# EAGLE design pui20 (EAGLE 9.5.2)
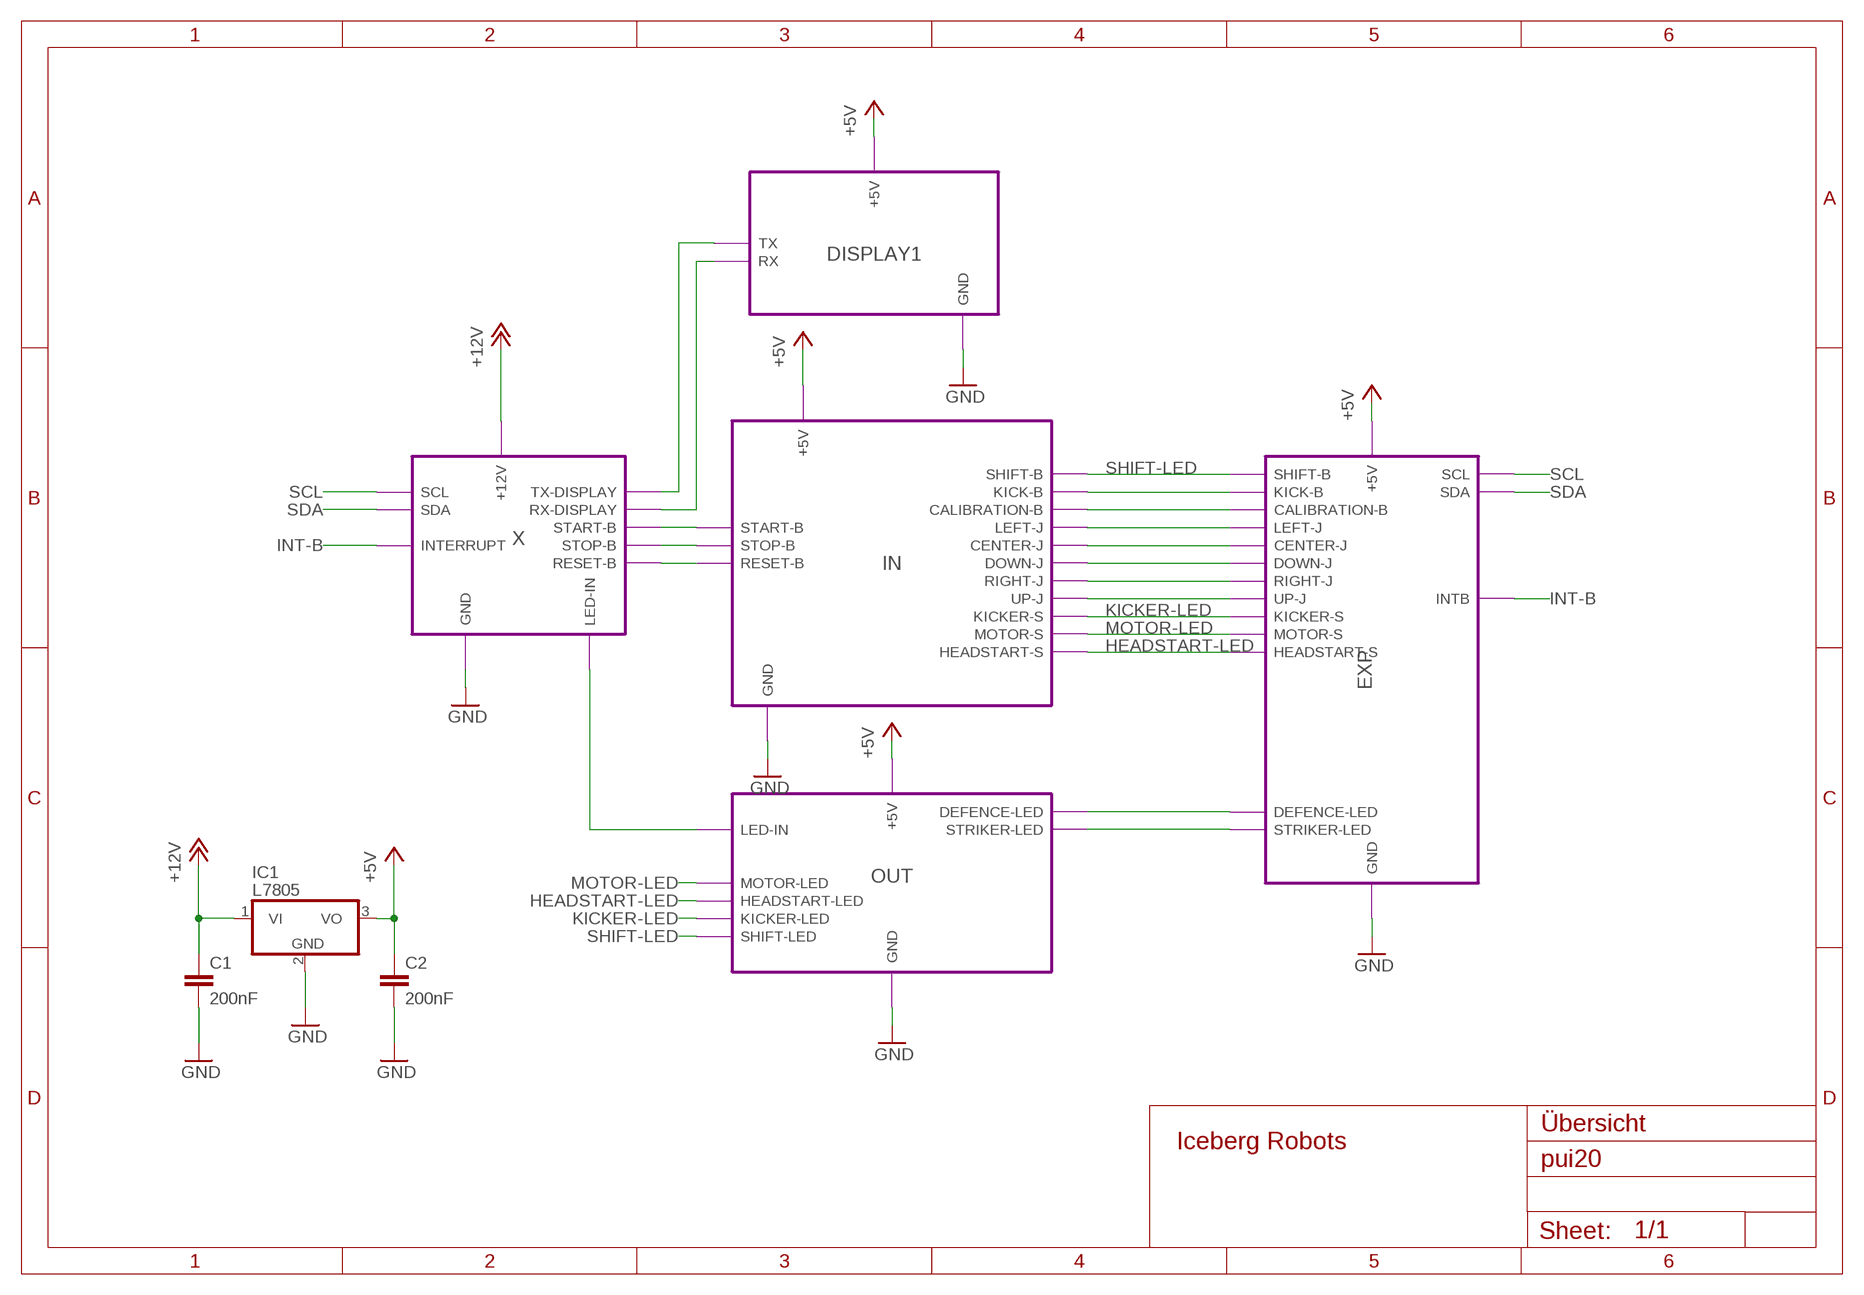
[diagram p0: schematic, sheet 1]

## Parts
C1  200nF  C0805  [C0805]
C2  200nF  C0805  [C0805]
IC1  L7805  [TO220V]

## Module instances
IN = EINGABE
X = ANSCHLUSS
OUT = AUSGABE
EXP = EXPANDER
DISPLAY1 = DISPLAY

## Nets
+5V: C2.1 IC1.3(VO) ; port EXP.+5V OUT.+5V DISPLAY1.+5V IN.+5V
+12V: C1.1 IC1.1(VI) ; port X.+12V
CALIBRATION-B: port IN.CALIBRATION-B EXP.CALIBRATION-B
CENTER-J: port IN.CENTER-J EXP.CENTER-J
DEFENCE-LED: port EXP.DEFENCE-LED OUT.DEFENCE-LED
DOWN-J: port IN.DOWN-J EXP.DOWN-J
GND: C1.2 C2.2 IC1.2(GND) ; port EXP.GND OUT.GND DISPLAY1.GND X.GND IN.GND
HEADSTART-LED: port OUT.HEADSTART-LED IN.HEADSTART-S EXP.HEADSTART-S
INT-B: port X.INTERRUPT EXP.INTB
KICK-B: port IN.KICK-B EXP.KICK-B
KICKER-LED: port OUT.KICKER-LED IN.KICKER-S EXP.KICKER-S
LED-IN: port X.LED-IN OUT.LED-IN
LEFT-J: port IN.LEFT-J EXP.LEFT-J
MOTOR-LED: port OUT.MOTOR-LED IN.MOTOR-S EXP.MOTOR-S
RESET-B: port X.RESET-B IN.RESET-B
RIGHT-J: port IN.RIGHT-J EXP.RIGHT-J
RX: port X.RX-DISPLAY DISPLAY1.RX
SCL: port X.SCL EXP.SCL
SDA: port X.SDA EXP.SDA
SHIFT-LED: port OUT.SHIFT-LED IN.SHIFT-B EXP.SHIFT-B
START-B: port IN.START-B X.START-B
STOP-B: port IN.STOP-B X.STOP-B
STRIKER-LED: port EXP.STRIKER-LED OUT.STRIKER-LED
TX: port DISPLAY1.TX X.TX-DISPLAY
UP-J: port IN.UP-J EXP.UP-J

## Notes on the sheet
- Übersicht

## Library data of the parts
C1 C2 = iceberg20:C: Capacitor, SMD 0805, Value wird festgelegt; BESTAND: -; HERSTELLER: -; HERSTELLER-NR: -; SUPPLIER: -; SUPPLIER-NR: -; TOLERANZ: 10%; V-MAX: 20V
IC1 = iceberg20:L7805: Spannungsregler, 5 V, TO220, 35 V Datenblatt: Link <https://www.buerklin.com/medias/sys_master/root/h6e/had/8866986229790/8866986229790.pdf>; BESTAND: ?; HERSTELLER: STMicroelectronics; HERSTELLER-NR: L7805AB-V; SUPPLIER: Bürklin; SUPPLIER-NR: 40S9756

## Module EINGABE
Ports: RESET-B(out) KICKER-S(out) HEADSTART-S(out) MOTOR-S(out) KICK-B(out) SHIFT-B(out) CALIBRATION-B(out) CENTER-J(out) DOWN-J(out) LEFT-J(out) RIGHT-J(out) UP-J(out) START-B(out) STOP-B(out) +5V(pwr) GND(pwr)
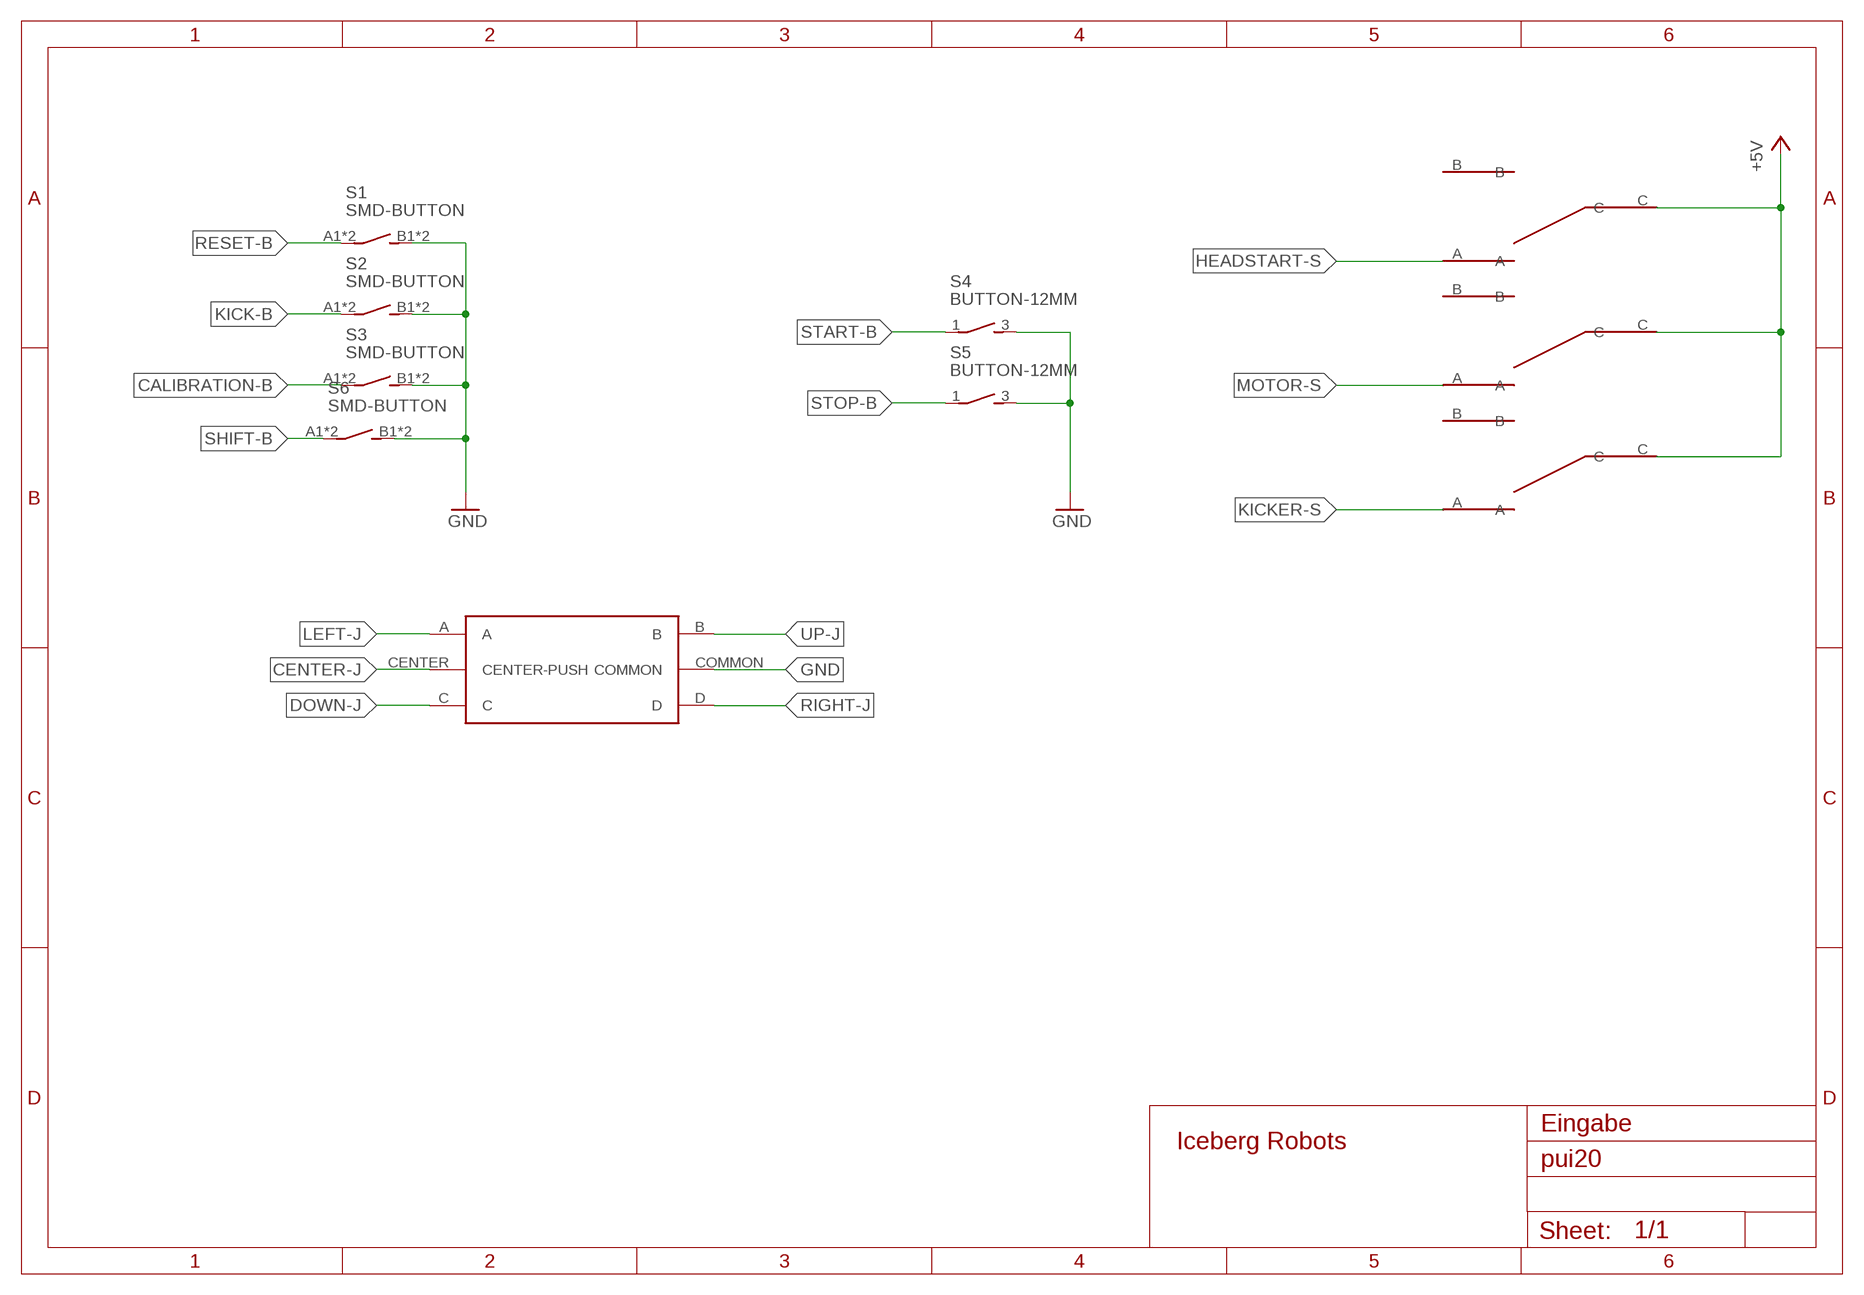
[diagram p1: schematic, module EINGABE, sheet 1]

### Parts
S1  SMD-BUTTON  [SWITCH-6MM-SMD]
S2  SMD-BUTTON  [SWITCH-6MM-SMD]
S3  SMD-BUTTON  [SWITCH-6MM-SMD]
S4  BUTTON-12MM  [SWITCH-12MM-THT]
S5  BUTTON-12MM  [SWITCH-12MM-THT]
S6  SMD-BUTTON  [SWITCH-6MM-SMD]
S7  TOGGLE-SWITCH  [TOGGLE-SWITCH]
S8  TOGGLE-SWITCH  [TOGGLE-SWITCH]
S9  TOGGLE-SWITCH  [TOGGLE-SWITCH]
U$1  JOYSTICK  [SKRHAAE010]

### Nets
+5V: S7.C S8.C S9.C
CALIBRATION-B: S3.A1(P) S3.A2(P)
CENTER-J: U$1.CENTER(CENTER-PUSH)
DOWN-J: U$1.C
GND: S1.B1(S) S1.B2(S) S2.B1(S) S2.B2(S) S3.B1(S) S3.B2(S) S4.3(S) S5.3(S) S6.B1(S) S6.B2(S) U$1.COMMON
HEADSTART-S: S7.A
KICK-B: S2.A1(P) S2.A2(P)
KICKER-S: S9.A
LEFT-J: U$1.A
MOTOR-S: S8.A
RESET-B: S1.A1(P) S1.A2(P)
RIGHT-J: U$1.D
SHIFT-B: S6.A1(P) S6.A2(P)
START-B: S4.1(P)
STOP-B: S5.1(P)
UP-J: U$1.B
Unconnected: S7.B S8.B S9.B

### Notes on the sheet
- Eingabe

### Library data of the parts
S1-S3 S6 = iceberg20:SMD-BUTTON: SMD-Button, 6mm x 6mm Datenblatt: Link <https://www.buerklin.com/medias/sys_master/root/h03/h3f/8877444497438/8877444497438.pdf>; BESTAND: 0; HERSTELLER: Alcoswitch; HERSTELLER-NR: 4-1437565-1 FSM4JSMA; SUPPLIER: Bürklin; SUPPLIER-NR: 12G482
S4 S5 = iceberg20:BUTTON-12MM: BitKurzhubtaster, 1-polig, Schaltfunktion: SPST-NO , 1 Schließer, Anschluss: Leiterplattenanschluss, Schutzart: IP 67, Farbe Betätiger: gelb, Betätigungskraft: 2,55 N, Größe: 12x12 mm, Höhe: 4,3 mm Datenblatt: Link <https://www.buerklin.com/medias/sys_master/root/h57/h6b/8876470075422/8876470075422.pdf>; BESTAND: ?; HERSTELLER: Omron; HERSTELLER-NR: 13G7561; SUPPLIER: Bürklin; SUPPLIER-NR: B3F-4005
S7-S9 = iceberg20:TOGGLE-SWITCH: Bitte hier mit dem Befehl Description eine passende Beschreibung angeben (kann kurz sein) und Datenblatt verlinken Datenblatt: Link <https://www.iceberg-robots.de/>
U$1 = iceberg20:JOYSTICK: Multi-direktionale Schalter 4 Dir Center Push 50mA 12V DC Datenblatt: Link <https://www.mouser.de/datasheet/2/15/skqu-1155891.pdf>; BESTAND: 0; HERSTELLER: ALPS; HERSTELLER-NR: SKRHAAE010; SUPPLIER: Mouser; SUPPLIER-NR: 688-SKRHAAE010

## Module DISPLAY
Ports: +5V(pwr) GND(pwr) RX(in) TX(out)
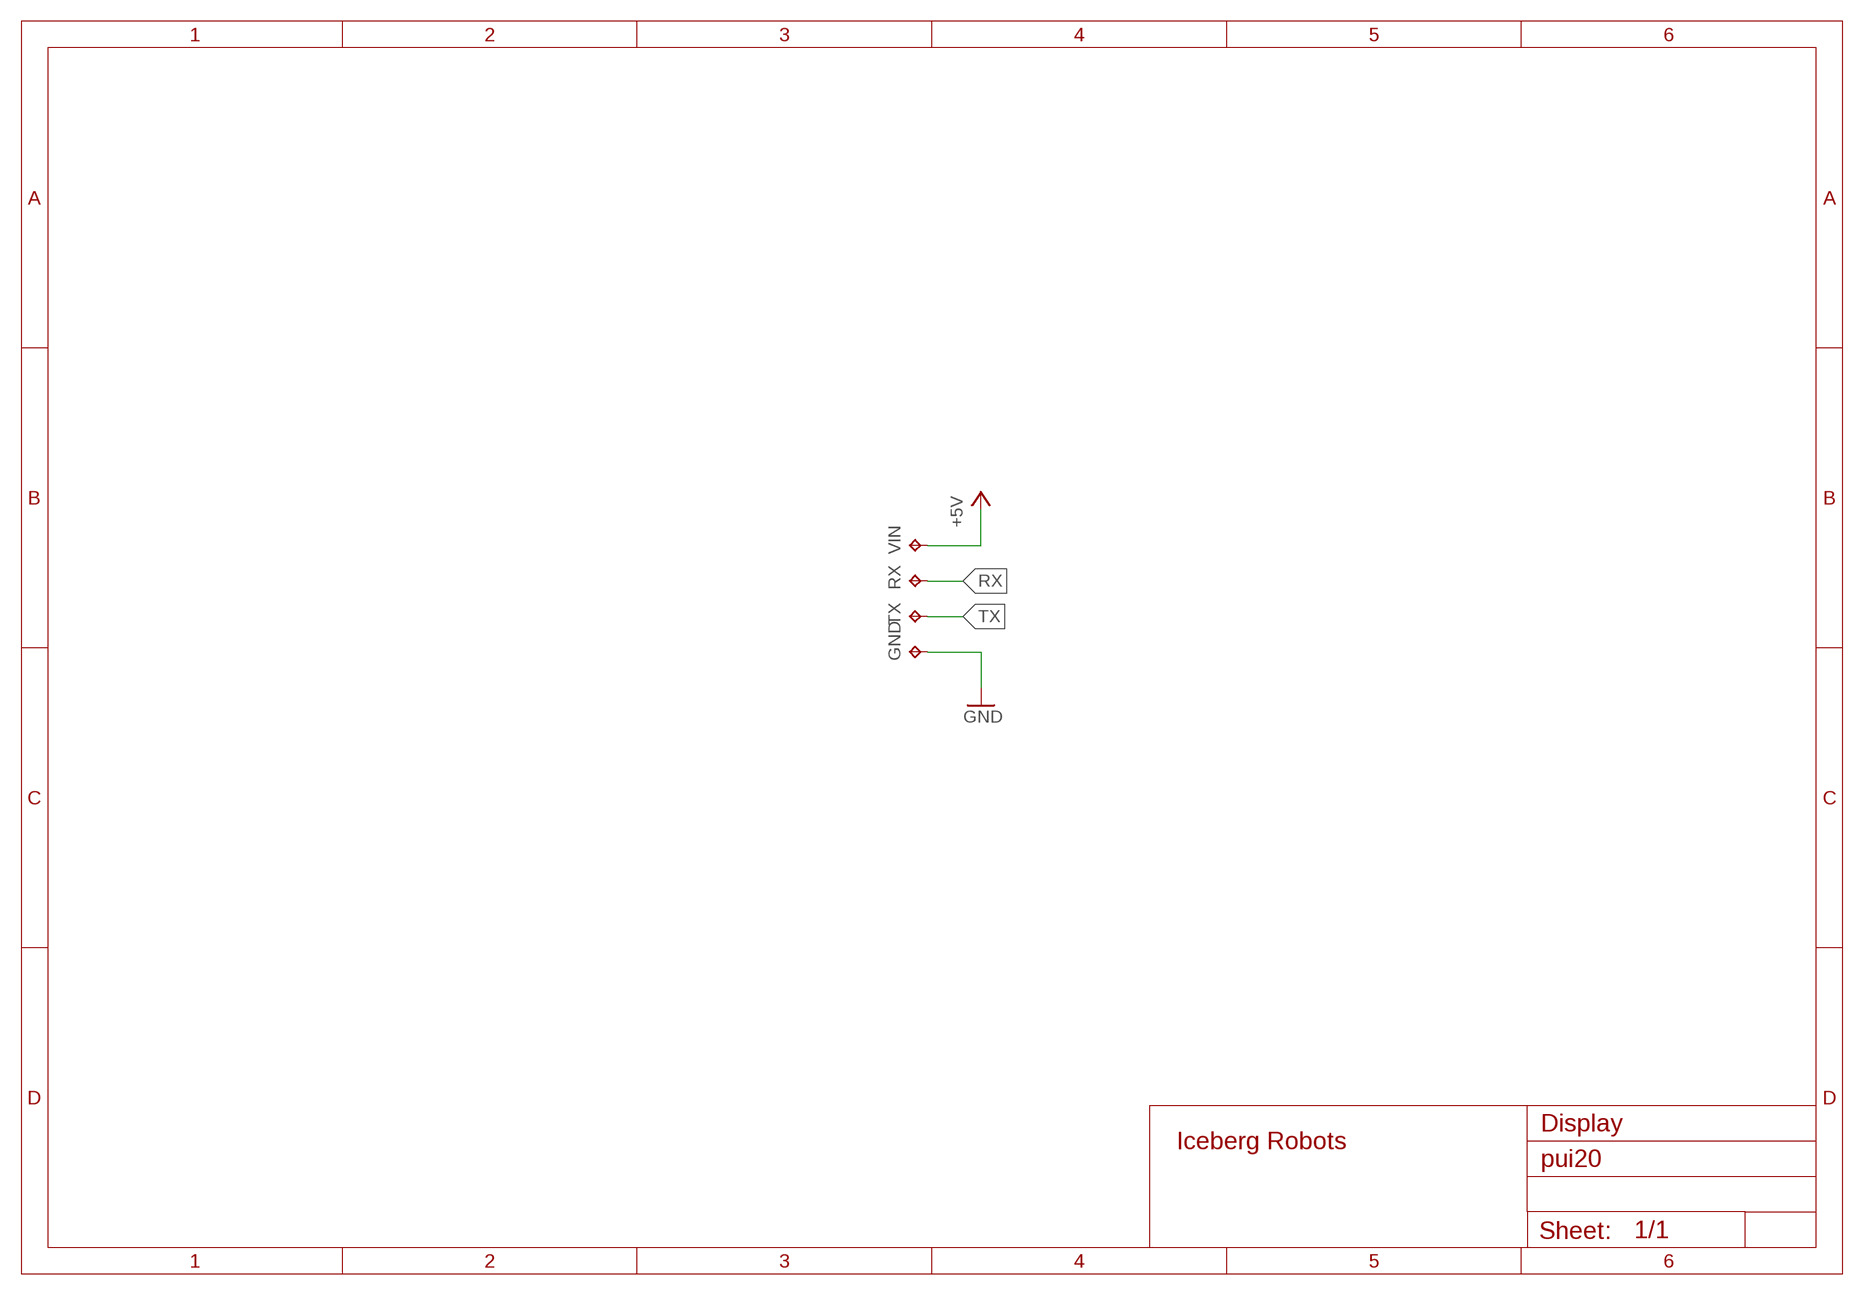
[diagram p2: schematic, module DISPLAY, sheet 1]

### Parts
GND  TESTPAD-LONG  [TESTPAD-LONG]
RX  TESTPAD-LONG  [TESTPAD-LONG]
TX  TESTPAD-LONG  [TESTPAD-LONG]
VIN  TESTPAD-LONG  [TESTPAD-LONG]

### Nets
+5V: VIN.P$1(TP)
GND: GND.P$1(TP)
RX: RX.P$1(TP)
TX: TX.P$1(TP)

### Notes on the sheet
- Display

### Library data of the parts
GND RX TX VIN = iceberg20:TESTPAD-LONG

## Module ANSCHLUSS
Ports: +12V(pwr) GND(pwr) RESET-B(in) LED-IN(out) SCL(io) SDA(io) RX-DISPLAY(out) TX-DISPLAY(in) START-B(in) STOP-B(in) INTERRUPT(in)
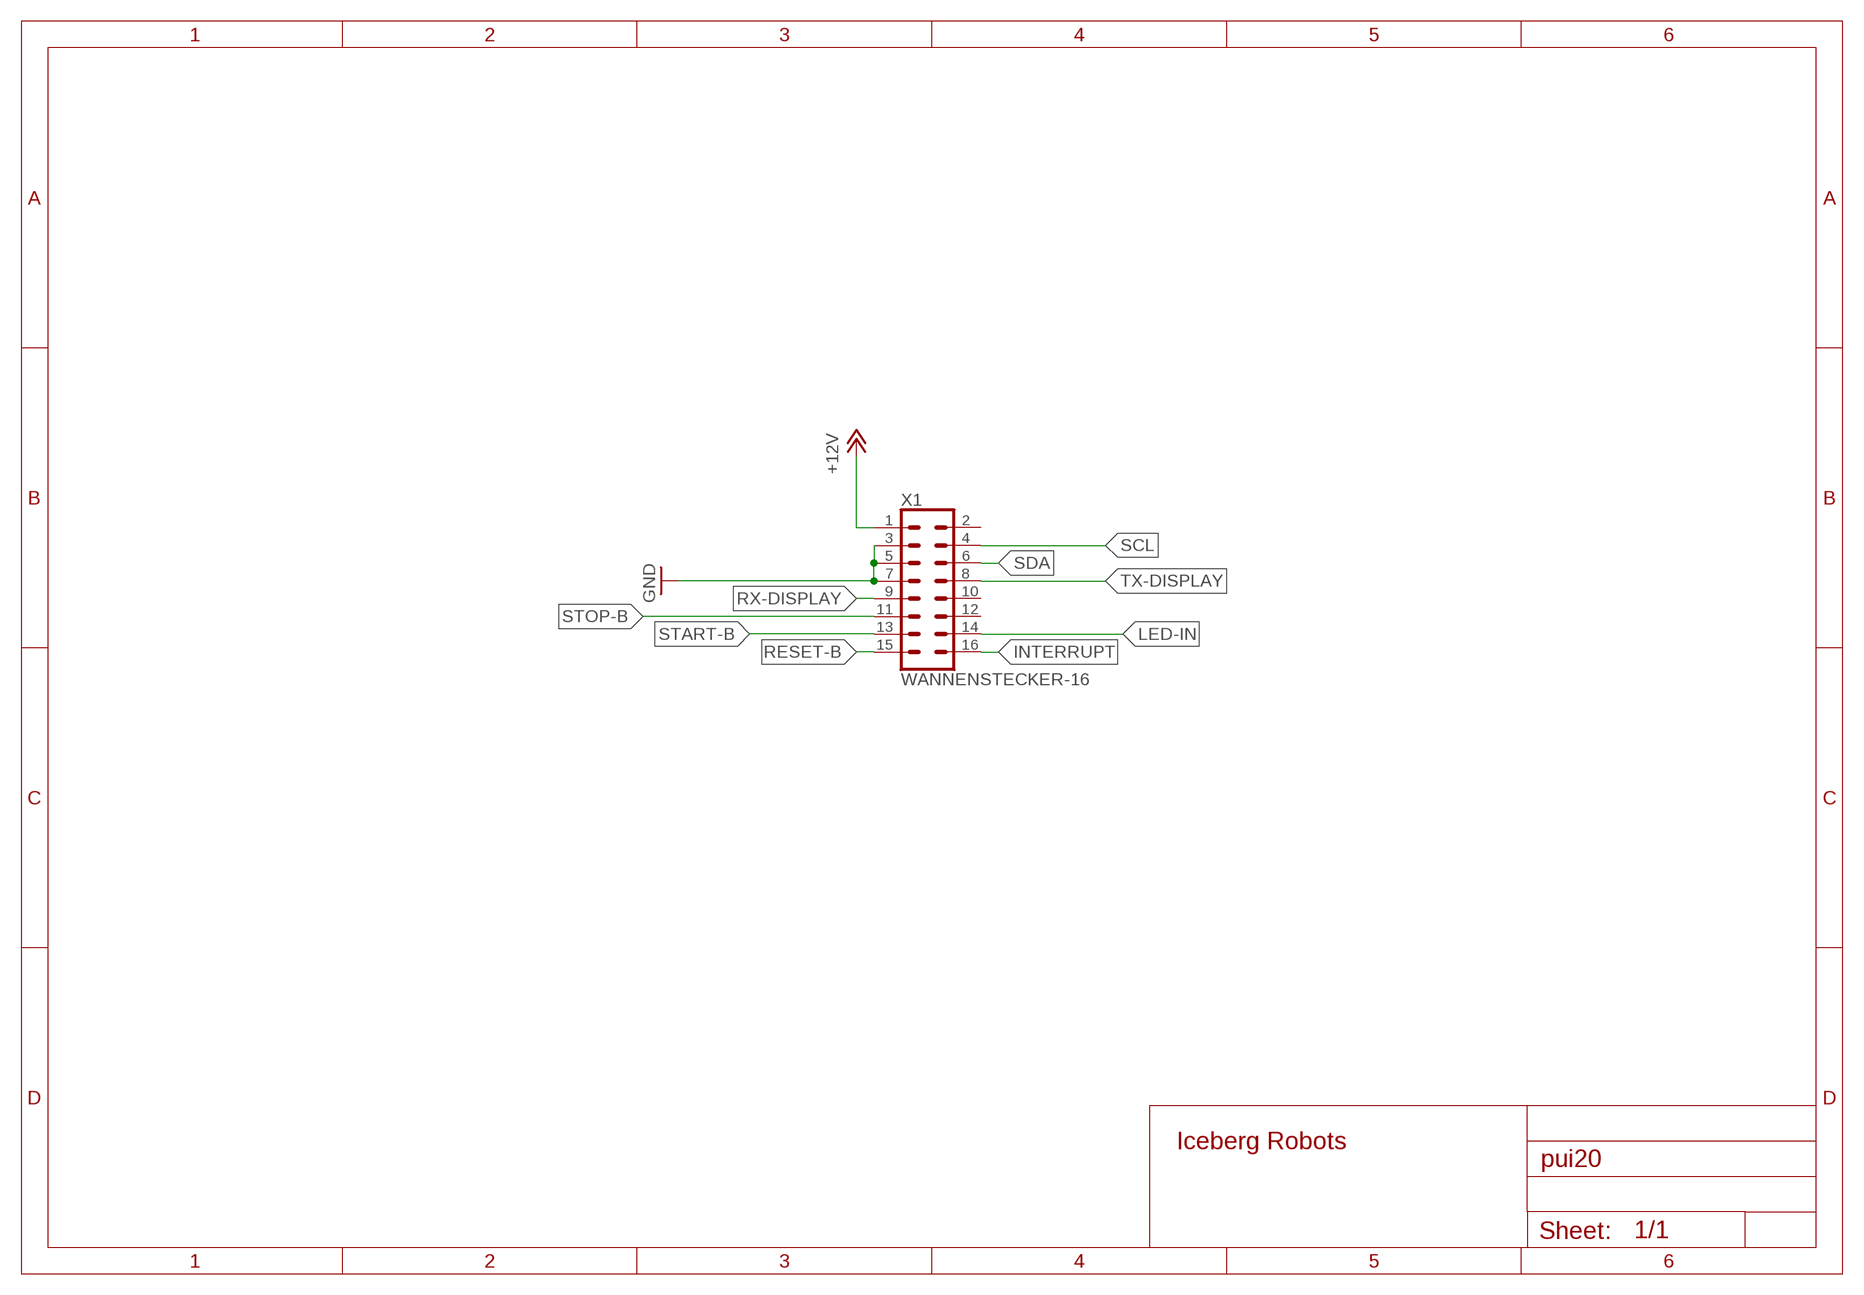
[diagram p3: schematic, module ANSCHLUSS, sheet 1]

### Parts
X1  WANNENSTECKER-16  [2X8]

### Nets
+12V: X1.1
GND: X1.3 X1.5 X1.7
INTERRUPT: X1.16
LED-IN: X1.14
RESET-B: X1.15
RX-DISPLAY: X1.9
SCL: X1.4
SDA: X1.6
START-B: X1.13
STOP-B: X1.11
TX-DISPLAY: X1.8
Unconnected: X1.2 X1.10 X1.12

### Library data of the parts
X1 = iceberg20:WANNENSTECKER-16: Bitte hier mit dem Befehl Description eine passende Beschreibung angeben (kann kurz sein) und Datenblatt verlinken Datenblatt: Link <https://www.iceberg-robots.de/>

## Module AUSGABE
Ports: LED-IN(in) HEADSTART-LED(in) KICKER-LED(in) MOTOR-LED(in) DEFENCE-LED(in) STRIKER-LED(in) SHIFT-LED(in) GND(pwr) +5V(pwr)
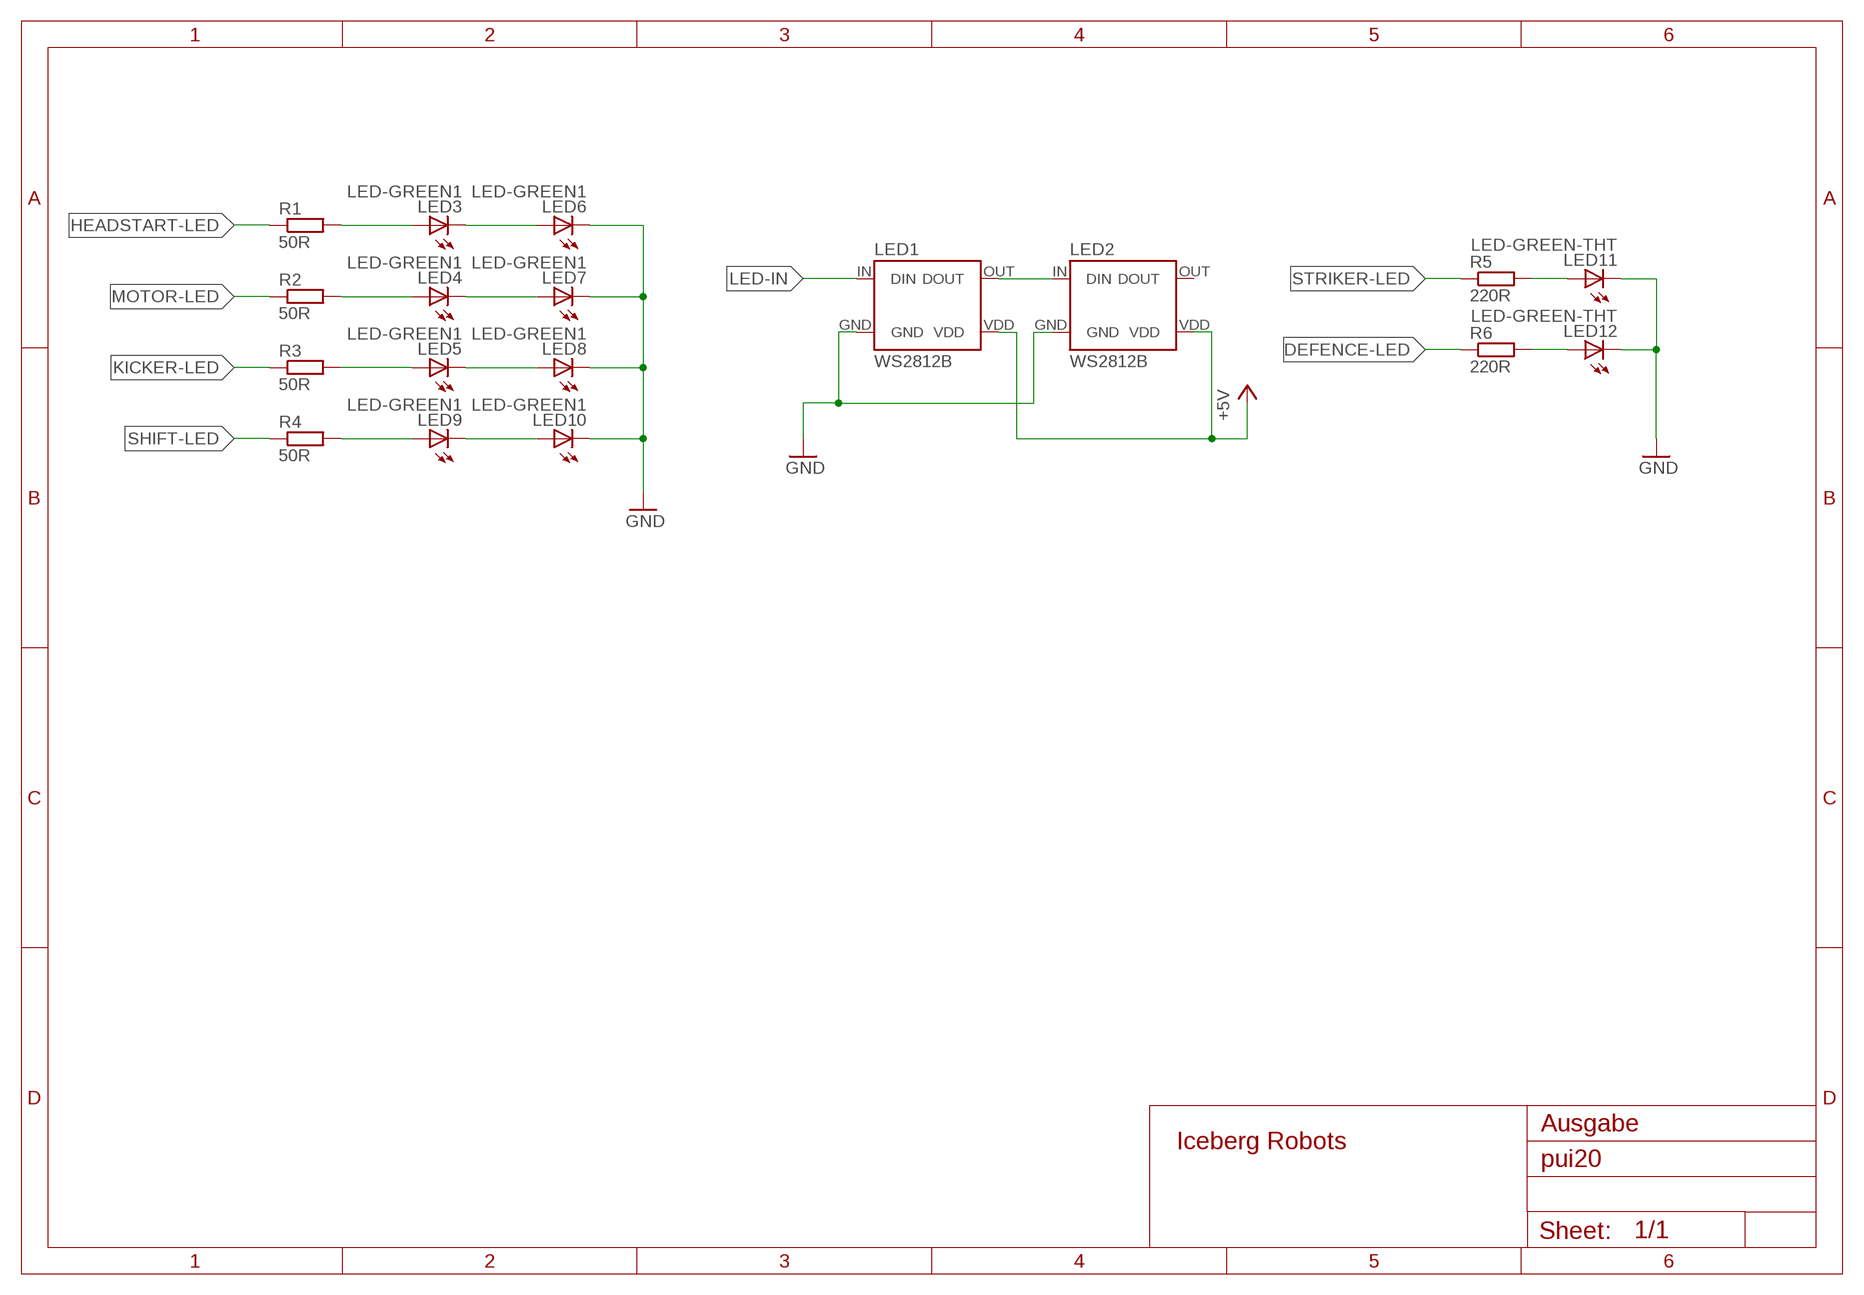
[diagram p4: schematic, module AUSGABE, sheet 1]

### Parts
LED1  WS2812B  [5050]
LED2  WS2812B  [5050]
LED3  LED-GREEN1  [1206]
LED4  LED-GREEN1  [1206]
LED5  LED-GREEN1  [1206]
LED6  LED-GREEN1  [1206]
LED7  LED-GREEN1  [1206]
LED8  LED-GREEN1  [1206]
LED9  LED-GREEN1  [1206]
LED10  LED-GREEN1  [1206]
LED11  LED-GREEN-THT  [LED_LED5MM]
LED12  LED-GREEN-THT  [LED_LED5MM]
R1  50R  R  [R0805]
R2  50R  R  [R0805]
R3  50R  R  [R0805]
R4  50R  R  [R0805]
R5  220R  R  [R0805]
R6  220R  R  [R0805]

### Nets
+5V: LED1.VDD LED2.VDD
DEFENCE-LED: R6.1
GND: LED1.GND LED2.GND LED6.C LED7.C LED8.C LED10.C LED11.K(C) LED12.K(C)
HEADSTART-LED: R1.1
KICKER-LED: R3.1
LED-IN: LED1.IN(DIN)
MOTOR-LED: R2.1
N$1: LED3.C LED6.A
N$2: LED3.A R1.2
N$3: LED4.C LED7.A
N$4: LED5.C LED8.A
N$5: LED1.OUT(DOUT) LED2.IN(DIN)
N$6: LED4.A R2.2
N$7: LED5.A R3.2
N$8: LED11.A R5.2
N$9: LED12.A R6.2
N$11: LED9.A R4.2
N$12: LED9.C LED10.A
SHIFT-LED: R4.1
STRIKER-LED: R5.1
Unconnected: LED2.OUT(DOUT)

### Notes on the sheet
- Ausgabe

### Library data of the parts
LED1 LED2 = iceberg20:WS2812B: SMD RGB LED Datenblatt: Link <https://cdn-shop.adafruit.com/datasheets/WS2812B.pdf>; BESTAND: ?; HERSTELLER: SparkFun Electronics; HERSTELLER-NR: COM-13667; SUPPLIER: Mouser; SUPPLIER-NR: 474-COM-13667
LED3-LED10 = iceberg20:LED-GREEN1: LED Green, 1206Datenblatt: Link <https://www.buerklin.com/medias/sys_master/root/h40/hdf/8866310357022/8866310357022.pdf>; HERSTELLER: EVERLIGHT; HERSTELLER-NR: 15-21SYGC/S530-E1/TR8 Everlight; SUPPLIER: Bürklin; SUPPLIER-NR: 67S2004
LED11 LED12 = iceberg20:LED-GREEN-THT: Bitte hier mit dem Befehl Description eine passende Beschreibung angeben (kann kurz sein) und Datenblatt verlinken Datenblatt: Link <https://www.iceberg-robots.de/>
R1-R6 = iceberg20:R: Resistor, SMD 0805, Value wird festgelegt; BESTAND: -; HERSTELLER: -; HERSTELLER-NR: -; SUPPLIER: -; SUPPLIER-NR: -; TOLERANZ: 5%

## Module EXPANDER
Ports: +5V(pwr) GND(pwr) SCL(io) SDA(io) SHIFT-B(in) KICK-B(in) CALIBRATION-B(in) LEFT-J(in) CENTER-J(in) DOWN-J(in) RIGHT-J(in) UP-J(in) KICKER-S(in) MOTOR-S(in) HEADSTART-S(in) DEFENCE-LED(out) STRIKER-LED(out) INTB(out)
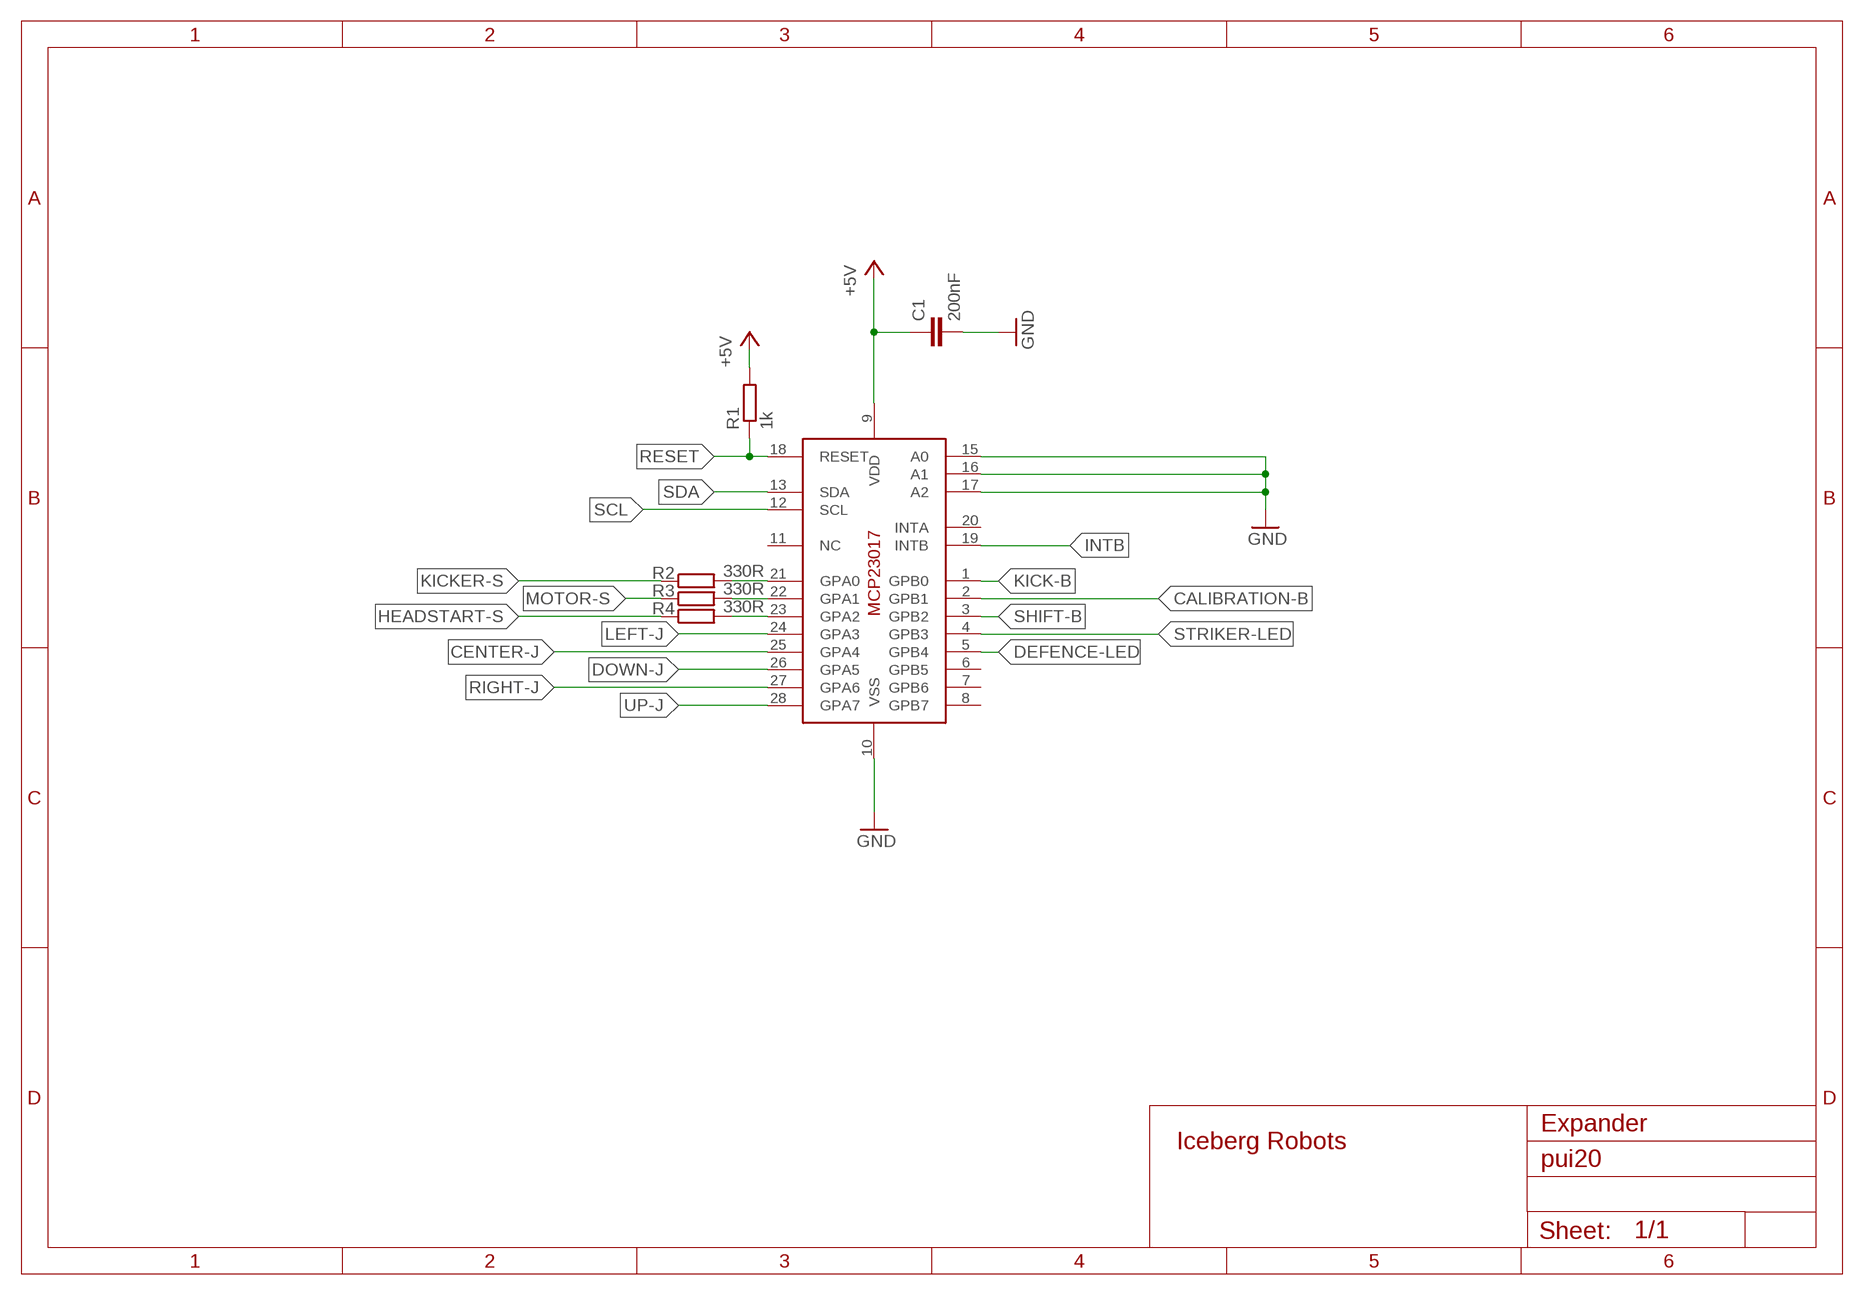
[diagram p5: schematic, module EXPANDER, sheet 1]

### Parts
C1  200nF  C0805  [C0805]
IC1  GPIO-EXPANDER  [DIL28-3]
R1  1k  R  [R0805]
R2  330R  R  [R0805]
R3  330R  R  [R0805]
R4  330R  R  [R0805]

### Nets
+5V: C1.1 IC1.9(VDD) R1.2
CALIBRATION-B: IC1.2(GPB1)
CENTER-J: IC1.25(GPA4)
DEFENCE-LED: IC1.5(GPB4)
DOWN-J: IC1.26(GPA5)
GND: C1.2 IC1.10(VSS) IC1.15(A0) IC1.16(A1) IC1.17(A2)
HEADSTART-S: R4.1
INTB: IC1.19(INTB)
KICK-B: IC1.1(GPB0)
KICKER-S: R2.1
LEFT-J: IC1.24(GPA3)
MOTOR-S: R3.1
N$1: IC1.21(GPA0) R2.2
N$2: IC1.22(GPA1) R3.2
N$3: IC1.23(GPA2) R4.2
RESET: IC1.18(RESET) R1.1
RIGHT-J: IC1.27(GPA6)
SCL: IC1.12(SCL)
SDA: IC1.13(SDA)
SHIFT-B: IC1.3(GPB2)
STRIKER-LED: IC1.4(GPB3)
UP-J: IC1.28(GPA7)
Unconnected: IC1.6(GPB5) IC1.7(GPB6) IC1.8(GPB7) IC1.11(NC) IC1.20(INTA)

### Notes on the sheet
- Expander

### Library data of the parts
C1 = iceberg20:C: Capacitor, SMD 0805, Value wird festgelegt; BESTAND: -; HERSTELLER: -; HERSTELLER-NR: -; SUPPLIER: -; SUPPLIER-NR: -; TOLERANZ: 10%; V-MAX: 20V
IC1 = iceberg20:GPIO-EXPANDER: MCP23017-E/SP Datenblatt: Link <https://www.mouser.de/datasheet/2/268/20001952C-1129816.pdf>
R1-R4 = iceberg20:R: Resistor, SMD 0805, Value wird festgelegt; BESTAND: -; HERSTELLER: -; HERSTELLER-NR: -; SUPPLIER: -; SUPPLIER-NR: -; TOLERANZ: 5%

## Board
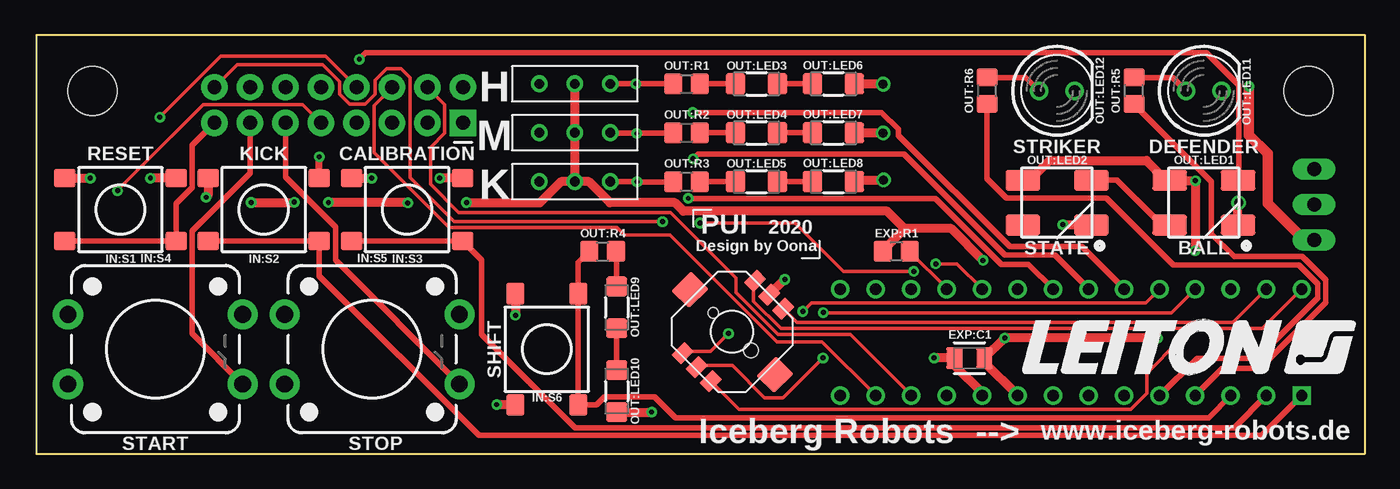
[diagram p6: board, top side]
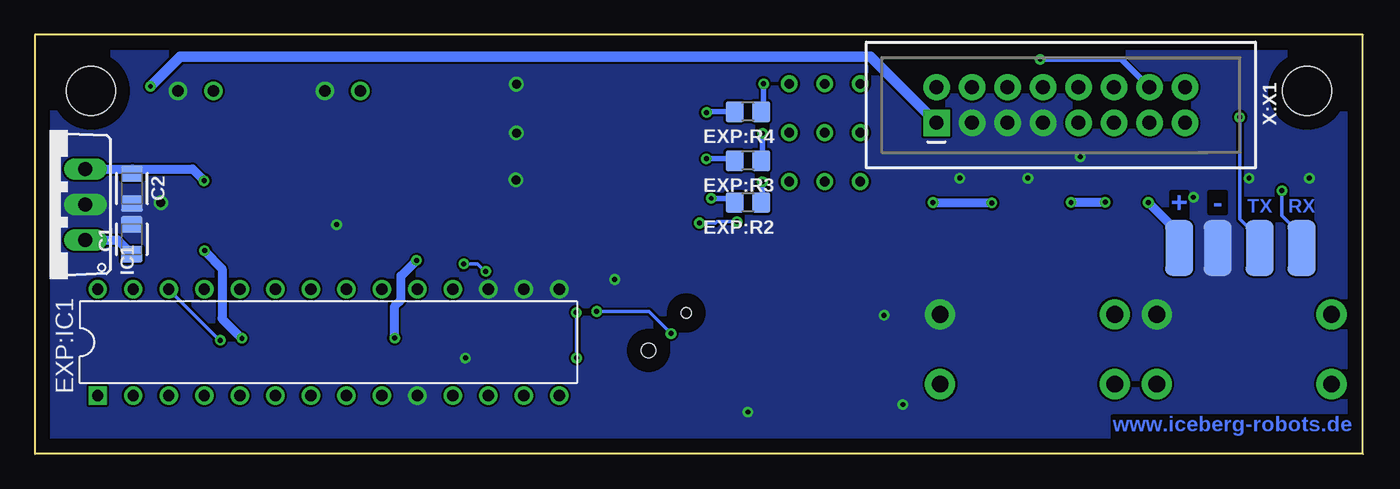
[diagram p7: board, bottom side, seen from below]

Size 95 x 30 mm. Coordinates in mm from the lower left corner, seen from the top.
Outline: 0,0 95,0 95,30 0,30 0,0
Copper layers (1*16): Top 0.035mm / dielectric 0.15mm / Bottom 0.035mm
Design rules "default *": minimum track width 6mil, minimum drill 0.35mm, track to track 6mil, track to pad 6mil, pad to pad 6mil, via to via 6mil, smd to smd 6mil, copper to edge 40mil, drill to drill 6mil, minimum pad ring 10mil, minimum via ring 8mil, stop-mask expansion 4mil, vias tented up to drill 15mil, thermal gap 10mil
Holes 3.5 mm at 4,26 91,26
tRestrict: area 0.7,22.7 to 7.3,29.3; area 87.7,22.7 to 94.3,29.3

### Footprints (pad centres in the part's own frame; a part is rotated, then mirrored left to right if it is on the bottom)
C0805 = smd 1.172 x 1.565: 1 -1.072,0; 2 1.072,0
TESTPAD-LONG = smd 4 x 2: P$1 0,0
DIL28-3 = drill 0.813 square: 1 -16.51,-3.81 | drill 0.813: 2 -13.97,-3.81; 3 -11.43,-3.81; 4 -8.89,-3.81; 5 -6.35,-3.81; 6 -3.81,-3.81; 7 -1.27,-3.81; 8 1.27,-3.81; 9 3.81,-3.81; 10 6.35,-3.81; 11 8.89,-3.81; 12 11.43,-3.81; 13 13.97,-3.81; 14 16.51,-3.81; 15 16.51,3.81; 16 13.97,3.81; 17 11.43,3.81; 18 8.89,3.81; 19 6.35,3.81; 20 3.81,3.81; 21 1.27,3.81; 22 -1.27,3.81; 23 -3.81,3.81; 24 -6.35,3.81; 25 -8.89,3.81; 26 -11.43,3.81; 27 -13.97,3.81; 28 -16.51,3.81
R0805 = smd 1.3 x 1.5: 1 -0.95,0; 2 0.95,0
TO220V = drill 1.016 long: 1 -2.54,-2.54; 2 0,-2.54; 3 2.54,-2.54
SWITCH-6MM-SMD = smd 1.55 x 1.3: A1 -3.975,-2.25; A2 3.975,-2.25; B1 -3.975,2.25; B2 3.975,2.25
SWITCH-12MM-THT = drill 1.2 pad 2.159: 1 6.25,-2.5; 2 -6.25,-2.5; 3 6.25,2.5; 4 -6.25,2.5
TOGGLE-SWITCH = drill 0.7: A -2.54,0; B 2.54,0; C 0,0
SKRHAAE010 = smd 2 x 1.8: 7 0,-4.35; 8 0,4.25 | smd 1.35 x 1: A -3.575,1.425; B 3.757,1.425; C -3.575,-1.425; CENTER -3.575,0; COMMON 3.757,0; D 3.757,-1.425 | hole 0.75: 0,1.9 | hole 1.05: 0,-1.9
5050 = smd 2.5 x 1.5: GND 2.45,-1.6; IN 2.45,1.6; OUT -2.45,-1.6; VDD -2.45,1.6
1206 = smd 1.4 x 1.5: A -1.5,0; C 1.5,0
LED_LED5MM = drill 0.813: A -1.27,0; K 1.27,0
2X8 = drill 1 pad 1.88 square: 1 -1.27,2.54 | drill 1 pad 1.88: 2 1.27,2.54; 3 -1.27,0; 4 1.27,0; 5 -1.27,-2.54; 6 1.27,-2.54; 7 -1.27,-5.08; 8 1.27,-5.08; 9 -1.27,-7.62; 10 1.27,-7.62; 11 -1.27,-10.16; 12 1.27,-10.16; 13 -1.27,-12.7; 14 1.27,-12.7; 15 -1.27,-15.24; 16 1.27,-15.24

### Placement (x,y rotation side)
C1  88.07,15.38 90 bottom
C2  88.06,19 270 bottom
DISPLAY1:GND  TESTPAD-LONG  [TESTPAD-LONG]  10.39,14.75 270 bottom
DISPLAY1:RX  TESTPAD-LONG  [TESTPAD-LONG]  4.39,14.75 270 bottom
DISPLAY1:TX  TESTPAD-LONG  [TESTPAD-LONG]  7.39,14.75 90 bottom
DISPLAY1:VIN  TESTPAD-LONG  [TESTPAD-LONG]  13.14,14.75 270 bottom
EXP:C1  200nF  [C0805]  66.74,6.86 180 top
EXP:IC1  GPIO-EXPANDER  [DIL28-3]  74,8 0 bottom
EXP:R1  1k  [R0805]  61.5,14.5 180 top
EXP:R2  330R  [R0805]  44,18 180 bottom
EXP:R3  330R  [R0805]  44,21 180 bottom
EXP:R4  330R  [R0805]  44,24.5 180 bottom
IC1  93.94,17.86 90 bottom
IN:S1  SMD-BUTTON  [SWITCH-6MM-SMD]  6,17.5 0 top
IN:S2  SMD-BUTTON  [SWITCH-6MM-SMD]  16.25,17.5 0 top
IN:S3  SMD-BUTTON  [SWITCH-6MM-SMD]  26.5,17.5 0 top
IN:S4  BUTTON-12MM  [SWITCH-12MM-THT]  8.5,7.5 0 top
IN:S5  BUTTON-12MM  [SWITCH-12MM-THT]  24,7.5 0 top
IN:S6  SMD-BUTTON  [SWITCH-6MM-SMD]  36.5,7.5 90 top
IN:S7  TOGGLE-SWITCH  [TOGGLE-SWITCH]  38.5,26.5 180 top
IN:S8  TOGGLE-SWITCH  [TOGGLE-SWITCH]  38.5,23 180 top
IN:S9  TOGGLE-SWITCH  [TOGGLE-SWITCH]  38.5,19.5 180 top
IN:U$1  JOYSTICK  [SKRHAAE010]  49.75,8.75 45 top
OUT:LED1  WS2812B  [5050]  83.5,18 0 top
OUT:LED2  WS2812B  [5050]  73,18 0 top
OUT:LED3  LED-GREEN1  [1206]  51.5,26.5 0 top
OUT:LED4  LED-GREEN1  [1206]  51.5,23 0 top
OUT:LED5  LED-GREEN1  [1206]  51.5,19.5 0 top
OUT:LED6  LED-GREEN1  [1206]  57,26.5 0 top
OUT:LED7  LED-GREEN1  [1206]  57,23 0 top
OUT:LED8  LED-GREEN1  [1206]  57,19.5 0 top
OUT:LED9  LED-GREEN1  [1206]  41.5,10.5 270 top
OUT:LED10  LED-GREEN1  [1206]  41.5,4.5 270 top
OUT:LED11  LED-GREEN-THT  [LED_LED5MM]  83.5,26 0 top
OUT:LED12  LED-GREEN-THT  [LED_LED5MM]  73,26 0 top
OUT:R1  50R  [R0805]  46.5,26.5 0 top
OUT:R2  50R  [R0805]  46.5,23 0 top
OUT:R3  50R  [R0805]  46.5,19.5 0 top
OUT:R4  50R  [R0805]  40.5,14.5 0 top
OUT:R5  220R  [R0805]  78.5,26 90 top
OUT:R6  220R  [R0805]  68,26 90 top
X:X1  WANNENSTECKER-16  [2X8]  27.96,24.98 90 bottom

### Tracks (layer width: path | path; a pad name or v marks a point on that pad's centre or on a via)
+5V  (via drill 0.35)
  Top 0.635: IN:S7.C IN:S8.C IN:S9.C | OUT:LED2.VDD 71.05,19.6 72.46,21.01 79.39,21.01 80.8,19.6 OUT:LED1.VDD 81.1,19.55 82.88,19.55 v82.9,19.57 v82.89,19.56 82.89,14.58 v82.87,14.56 | v80.2,8.28 80.17,8.31 v69.26,8.31 v69.25,8.31 EXP:C1.1 67.81,6.57 EXP:IC1.9 | v30.75,18 36.01,18 37.51,19.5 IN:S9.C | v67.71,13.86 65.43,16.14 62.08,16.14 | EXP:R1.2 60.55,14.57 62.1,16.12 62.08,16.14 | 62.08,16.14 60.83,17.38 46.27,17.38 45.66,18 41.01,18 39.51,19.5 IN:S9.C | v15.35,18 18.41,18 v18.43,18.02 | v20.87,18.01 26.52,18.01 v26.55,17.97
  Bottom 0.152: C2.1 88.06,20.37 88.03,20.4
  Bottom 0.635: IC1.3 88.03,20.4 83.73,20.4 v82.9,19.57 | v15.35,18 13.14,15.79 DISPLAY1:VIN.P$1 | v82.87,14.56 82.87,14.52 81.61,13.26 81.61,9.72 81.59,9.7 81.59,9.68 v80.2,8.28 | v69.26,8.31 69.26,10.6 68.82,11.04 68.82,12.75 v67.71,13.86 | v20.87,18.01 20.86,18.02 v18.43,18.02 | v26.55,17.97 30.72,17.97 v30.75,18
+12V  (via drill 0.35)
  Top 0.762: IC1.1 90.68,15.32 88.07,17.93 88.07,21.49 86.74,22.82 v86.74,26.32
  Bottom 0.635: IC1.1 89.09,15.32 C1.1
  Bottom 0.762: v86.74,26.32 84.61,28.44 35.23,28.44 X:X1.1
CALIBRATION-B
  Top 0.381: IN:S3.A1 IN:S3.A2 31.84,13.88 31.84,8.57 38.53,1.89 85.67,1.89 EXP:IC1.2
CENTER-J  (via drill 0.35)
  Top 0.254: EXP:IC1.25 81.19,10.11 56.3,10.11 v56.28,10.13 | v56.26,6.87 53.41,4.03 52.08,4.03 49.77,6.33 47.34,6.33 IN:U$1.CENTER
  Bottom 0.254: v56.28,10.13 56.26,10.11 v56.26,6.88 v56.26,6.87
DEFENCE-LED
  Top 0.381: OUT:R6.1 68,19.71 69.38,18.34 76.52,18.34 81.33,13.52 90.31,13.52 91.64,12.19 91.64,11.17 87.33,6.86 83.02,6.86 EXP:IC1.5
DOWN-J  (via drill 0.35)
  Top 0.254: IN:U$1.C 50.24,3.21 78.28,3.21 79.41,4.34 79.41,5.78 81.74,8.12 v81.74,8.14
  Bottom 0.254: v81.74,8.14 81.77,8.14 85.43,11.79 EXP:IC1.26
EXP:N$1  (via drill 0.35)
  Top 0.381: v46.62,18.3 64.29,18.3 69.01,13.58 70.96,13.58 EXP:IC1.21
  Bottom 0.381: EXP:R2.2 45.25,18.3 46.14,18.3 46.15,18.3 v46.62,18.3
EXP:N$2  (via drill 0.35)
  Top 0.381: v46.96,21.13 47.31,21.48 62.04,21.48 69.28,14.24 72.85,14.24 EXP:IC1.22
  Bottom 0.381: EXP:R3.2 45.08,21.13 v46.96,21.13
EXP:N$3  (via drill 0.35)
  Top 0.381: v46.95,24.44 60.46,24.44 61.66,23.24 61.66,22.81 69.62,14.84 74.78,14.84 EXP:IC1.23
  Bottom 0.381: EXP:R4.2 46.9,24.5 v46.95,24.44
EXP:RESET
  Top 0.254: EXP:R1.1 65.11,11.84 EXP:IC1.18
GND  (via drill 0.35, 0.64)
  Top 0.508: IN:S2.B2 v20.23,21.27
  Top 0.635: OUT:LED6.C 60.53,26.5 v60.55,26.48 | OUT:LED7.C 60.53,23 v60.55,22.98 | OUT:LED8.C 58.62,19.62 v60.59,19.62 | OUT:LED1.GND 85.95,17.95 v85.99,18 | OUT:LED10.C v44,3 | OUT:LED2.GND 73.43,16.4 v73.42,16.41 | IN:S1.B1 v3.83,19.75 | IN:S1.B2 v8.14,19.75 | IN:S2.B1 12.28,18.53 v12.12,18.38 | IN:S2.B2 20.09,19.89 | IN:S3.B1 v23.97,19.75 | IN:S6.B1 32.93,3.52 v32.91,3.54 | IN:S3.B2 v28.84,19.75 v28.84,19.74 | IN:S6.B2 v34.25,9.94 v34.26,9.93 | IN:U$1.COMMON 53.5,12.5 v53.52,12.5 | EXP:IC1.10 67.65,4.38 65.67,6.36 EXP:C1.2 v64.21,6.86 v64.2,6.87
  pour Bottom (no thermals): -5,32 -5,-3.06 100,-3.06 100,32.08
HEADSTART-LED  (via drill 0.35)
  Top 0.381: OUT:R1.1 v42.88,26.5 IN:S7.A
  Bottom 0.381: v42.88,26.5 42.88,24.67 EXP:R4.1
INT-B  (via drill 0.35)
  Top 0.254: EXP:IC1.19 65.85,13.61 v64.32,13.61 | X:X1.16 14.34,27.87 20.45,27.87 21.66,26.66 21.66,25.75 22.38,25.03 23.49,25.03 24.2,25.75 24.2,26.76 25.03,27.58 26.09,27.58 26.72,26.95 26.72,19.78 29.85,16.64 v44.78,16.64 | v47.46,16.53 54.27,16.53 57.73,13.07 v62.76,13.07
  Bottom 0.254: v64.32,13.61 63.35,13.61 62.81,13.07 v62.76,13.07 | v44.78,16.64 46.2,16.64 46.3,16.53 v47.46,16.53
KICK-B
  Top 0.381: IN:S2.A1 IN:S2.A2 20.23,12.76 31.66,1.33 87.65,1.33 EXP:IC1.1
KICKER-LED  (via drill 0.35)
  Top 0.381: OUT:R3.1 45.53,19.48 v42.96,19.48 42.94,19.5 IN:S9.A
  Bottom 0.381: v42.95,19.48 v42.96,19.48 42.96,18.09 EXP:R2.1
LED-IN  (via drill 0.35)
  Top 0.381: OUT:LED1.IN 85.99,19.6 85.99,26.41 83.67,28.72 23.55,28.72 23.55,28.71 v23.09,28.25
  Bottom 0.381: X:X1.14 17.26,28.25 v23.09,28.25
LEFT-J  (via drill 0.35)
  Top 0.254: EXP:IC1.24 79.34,10.8 55.42,10.8 v54.82,10.2 | IN:U$1.A 46.32,7.33 48.2,7.33 v49.5,8.63
  Bottom 0.254: v54.82,10.2 v54.81,10.21 51.08,10.21 v49.5,8.63
MOTOR-LED  (via drill 0.35)
  Top 0.381: OUT:R2.1 45.5,22.95 v42.94,22.95 41.09,22.95 IN:S8.A
  Bottom 0.381: v42.95,22.94 v42.94,22.95 42.94,21.11 EXP:R3.1
OUT:N$1
  Top 0.381: OUT:LED3.C OUT:LED6.A
OUT:N$2
  Top 0.381: OUT:R1.2 OUT:LED3.A
OUT:N$3
  Top 0.381: OUT:LED4.C OUT:LED7.A
OUT:N$4
  Top 0.381: OUT:LED5.C OUT:LED8.A
OUT:N$5
  Top 0.381: OUT:LED1.OUT 80.48,16.4 77.28,19.6 OUT:LED2.IN
OUT:N$6
  Top 0.381: OUT:R2.2 OUT:LED4.A
OUT:N$7
  Top 0.381: OUT:R3.2 OUT:LED5.A
OUT:N$8
  Top 0.381: OUT:R5.2 81.28,26.95 OUT:LED11.A
OUT:N$9
  Top 0.381: OUT:R6.2 70.78,26.95 OUT:LED12.A
OUT:N$11
  Top 0.381: OUT:LED9.A 41.5,14.45 OUT:R4.2
OUT:N$12
  Top 0.381: OUT:LED10.A OUT:LED9.C
RESET-B
  Top 0.381: X:X1.15 11.12,22.11 11.12,19.07 9.97,17.92 IN:S1.A2 IN:S1.A1
RIGHT-J
  Top 0.254: IN:U$1.D 54.39,9.42 85.58,9.42 EXP:IC1.27
RX  (via drill 0.35)
  Top 0.254: X:X1.9 19.03,25.02 11.93,25.02 5.79,18.88 v5.79,18.85
  Bottom 0.254: DISPLAY1:RX.P$1 4.39,15.69 5.79,17.09 v5.79,18.85
SCL
  Top 0.254: EXP:IC1.12 58.2,8.56 53.03,8.56 50.03,11.55 50.03,12.6 45.33,17.3 30.18,17.3 28.17,19.31 28.17,21.93 29.2,22.96 29.2,25.02 X:X1.4
SDA
  Top 0.254: X:X1.6 25.42,26.23 24.14,24.94 24.14,21.56 29.49,16.2 41.52,16.2 42.05,15.68 45.33,15.68 52.97,8.04 56.18,8.04 EXP:IC1.13
SHIFT-LED
  Top 0.381: OUT:R4.1 38.75,13.7 IN:S6.A2 IN:S6.A1 40.07,3.52 40.63,4.09 44.2,4.09 45.69,2.6 83.84,2.6 EXP:IC1.3
START-B
  Top 0.381: IN:S4.1 11.12,8.63 11.12,15.95 15.27,20.1 15.27,23.7 X:X1.13
STOP-B
  Top 0.381: IN:S5.1 21.38,13.87 21.38,16.23 17.8,19.81 X:X1.11
STRIKER-LED
  Top 0.381: OUT:R5.1 84.06,19.5 84.06,15.77 85.69,14.13 90.55,14.13 92.23,12.45 92.23,10.85 87.5,6.12 84.82,6.12 EXP:IC1.4
TX  (via drill 0.35)
  Top 0.254: v8.81,24.11 13.17,28.47 20.67,28.47 X:X1.8
  Bottom 0.254: DISPLAY1:TX.P$1 7.39,15.42 8.8,16.84 8.8,24.1 v8.81,24.11
UP-J
  Top 0.254: EXP:IC1.28 87.67,8.97 53.24,8.97 51.3,10.92 51.3,12.31 IN:U$1.B

### Text on the board
Bottom: RX | TX | - | + | www.iceberg-robots.de
tNames: H | M | STRIKER | DEFENDER | RESET | KICK | CALIBRATION | K | PUI | 2020 | Design by Oona | STATE | BALL | SHIFT | Iceberg Robots | --> | www.iceberg-robots.de | START | STOP